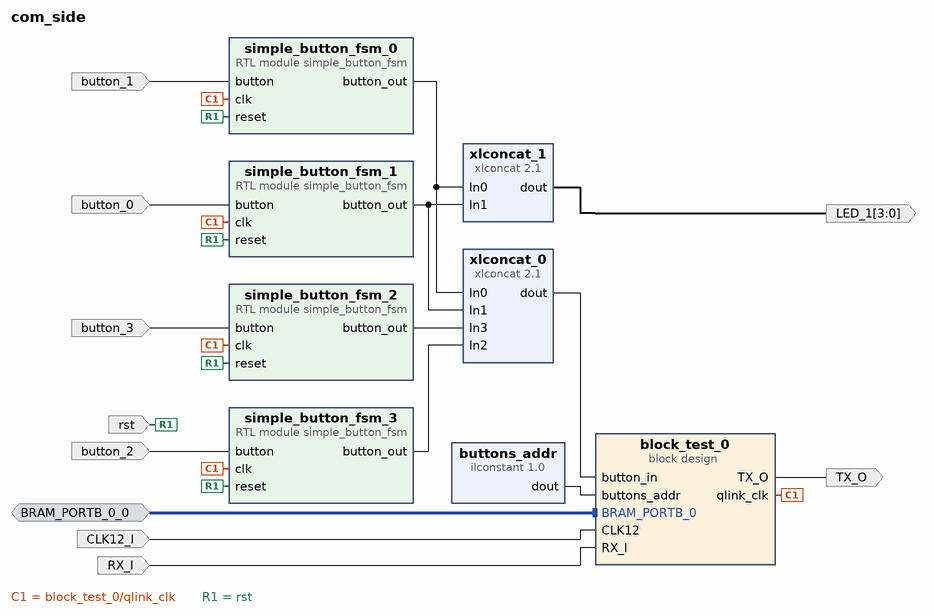
[diagram p0: block diagram of the top level]
# Vivado block design com_side, xc7s15ftgb196-1, Vivado 2025.2
create_bd_design com_side

create_bd_intf_port -mode Slave -vlnv xilinx.com:interface:bram_rtl:1.0 BRAM_PORTB_0_0
set_property -dict {CONFIG.MASTER_TYPE BRAM_CTRL CONFIG.READ_WRITE_MODE READ_WRITE} [get_bd_intf_ports BRAM_PORTB_0_0]
create_bd_port -dir I button_0
create_bd_port -dir I button_1
create_bd_port -dir I button_2
create_bd_port -dir I button_3
create_bd_port -dir I -type rst rst
create_bd_port -dir I CLK12_I
create_bd_port -dir I RX_I
create_bd_port -dir O TX_O
create_bd_port -dir O -from 3 -to 0 LED_1

create_bd_cell -type module -reference simple_button_fsm simple_button_fsm_0
create_bd_cell -type module -reference simple_button_fsm simple_button_fsm_1
create_bd_cell -type module -reference simple_button_fsm simple_button_fsm_2
create_bd_cell -type module -reference simple_button_fsm simple_button_fsm_3
create_bd_cell -type ip -vlnv xilinx.com:ip:xlconcat:2.1 xlconcat_0
set_property -dict {CONFIG.NUM_PORTS 4} [get_bd_cells xlconcat_0]
create_bd_cell -type container -reference block_test block_test_0
set_property -dict [list \
  CONFIG.ACTIVE_SIM_BD block_test.bd \
  CONFIG.ACTIVE_SYNTH_BD block_test.bd \
  CONFIG.ENABLE_DFX 0 \
  CONFIG.LIST_SIM_BD block_test.bd \
  CONFIG.LIST_SYNTH_BD block_test.bd \
  CONFIG.LOCK_PROPAGATE 0 \
] [get_bd_cells block_test_0]
create_bd_cell -type ip -vlnv xilinx.com:ip:xlconcat:2.1 xlconcat_1
create_bd_cell -type inline_hdl -vlnv xilinx.com:inline_hdl:ilconstant:1.0 buttons_addr
set_property -dict {CONFIG.CONST_VAL 800 CONFIG.CONST_WIDTH 32} [get_bd_cells buttons_addr]

# ---- connections ----

connect_bd_intf_net -intf_net BRAM_PORTB_0_0_1 [get_bd_intf_ports BRAM_PORTB_0_0] [get_bd_intf_pins block_test_0/BRAM_PORTB_0]
connect_bd_net -net CLK12_I_0_1 [get_bd_ports CLK12_I] [get_bd_pins block_test_0/CLK12]
connect_bd_net -net RX_I_0_1 [get_bd_ports RX_I] [get_bd_pins block_test_0/RX_I]
connect_bd_net [get_bd_pins block_test_0/TX_O] [get_bd_ports TX_O]
connect_bd_net -net block_test_0_qlink_clk_o [get_bd_pins block_test_0/qlink_clk] \
  [get_bd_pins simple_button_fsm_0/clk] [get_bd_pins simple_button_fsm_1/clk] [get_bd_pins simple_button_fsm_2/clk] \
  [get_bd_pins simple_button_fsm_3/clk]
connect_bd_net -net button_0_1 [get_bd_ports button_0] [get_bd_pins simple_button_fsm_1/button]
connect_bd_net -net button_1_1 [get_bd_ports button_1] [get_bd_pins simple_button_fsm_0/button]
connect_bd_net -net button_2_1 [get_bd_ports button_2] [get_bd_pins simple_button_fsm_3/button]
connect_bd_net -net button_3_1 [get_bd_ports button_3] [get_bd_pins simple_button_fsm_2/button]
connect_bd_net -net ilconstant_0_dout [get_bd_pins buttons_addr/dout] [get_bd_pins block_test_0/buttons_addr]
connect_bd_net -net reset_0_1 [get_bd_ports rst] \
  [get_bd_pins simple_button_fsm_0/reset] [get_bd_pins simple_button_fsm_1/reset] [get_bd_pins simple_button_fsm_2/reset] \
  [get_bd_pins simple_button_fsm_3/reset]
connect_bd_net [get_bd_pins simple_button_fsm_0/button_out] [get_bd_pins xlconcat_0/In0] [get_bd_pins xlconcat_1/In0]
connect_bd_net [get_bd_pins simple_button_fsm_1/button_out] [get_bd_pins xlconcat_0/In1] [get_bd_pins xlconcat_1/In1]
connect_bd_net [get_bd_pins simple_button_fsm_2/button_out] [get_bd_pins xlconcat_0/In3] [get_bd_pins ilconcat_0/In1]
connect_bd_net [get_bd_pins simple_button_fsm_3/button_out] [get_bd_pins xlconcat_0/In2] [get_bd_pins ilconcat_0/In0]
connect_bd_net [get_bd_pins xlconcat_0/dout] [get_bd_pins block_test_0/button_in]
connect_bd_net [get_bd_pins xlconcat_1/dout] [get_bd_ports LED_1]

validate_bd_design
save_bd_design
